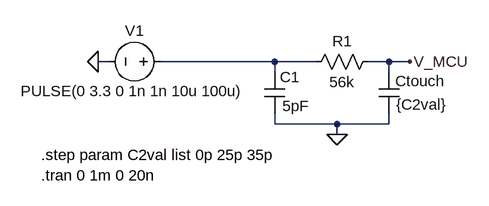
[diagram p0: schematic Draft1.asc]
Draft1.asc, the LTspice schematic file:
Version 4
SHEET 1 880 680
WIRE -400 112 -416 112
WIRE -144 112 -320 112
WIRE -80 112 -144 112
WIRE 32 112 0 112
WIRE 64 112 32 112
WIRE -144 128 -144 112
WIRE 32 128 32 112
WIRE -144 208 -144 192
WIRE -48 208 -144 208
WIRE 32 208 32 192
WIRE 32 208 -48 208
WIRE -48 224 -48 208
FLAG -48 224 0
FLAG -416 112 0
FLAG 64 112 V_MCU
SYMBOL cap -160 128 R0
WINDOW 3 28 52 Left 2
SYMATTR InstName C1
SYMATTR Value 5pF
SYMBOL cap 16 128 R0
WINDOW 0 26 14 Left 2
WINDOW 3 27 50 Left 2
SYMATTR InstName Ctouch
SYMATTR Value {C2val}
SYMBOL res 16 96 R90
WINDOW 0 0 56 VBottom 2
WINDOW 3 32 56 VTop 2
SYMATTR InstName R1
SYMATTR Value 56k
SYMBOL voltage -304 112 R90
WINDOW 0 -32 56 VBottom 2
WINDOW 3 61 59 VBottom 2
WINDOW 123 0 0 Left 0
WINDOW 39 0 0 Left 0
SYMATTR InstName V1
SYMATTR Value PULSE(0 3.3 0 1n 1n 10u 100u)
TEXT -504 256 Left 2 !.step param C2val list 0p 25p 35p\n.tran 0 1m 0 20n

The netlist it stands for:
* Draft1.asc
C1 N001 0 5pF
Ctouch V_MCU 0 {C2val}
R1 V_MCU N001 56k
V1 N001 0 PULSE(0 3.3 0 1n 1n 10u 100u)
.step param C2val list 0p 25p 35p
.tran 0 1m 0 20n
.backanno
.end